# EAGLE schematic 6ButtonSMDVerteiler (EAGLE 9.6.2)
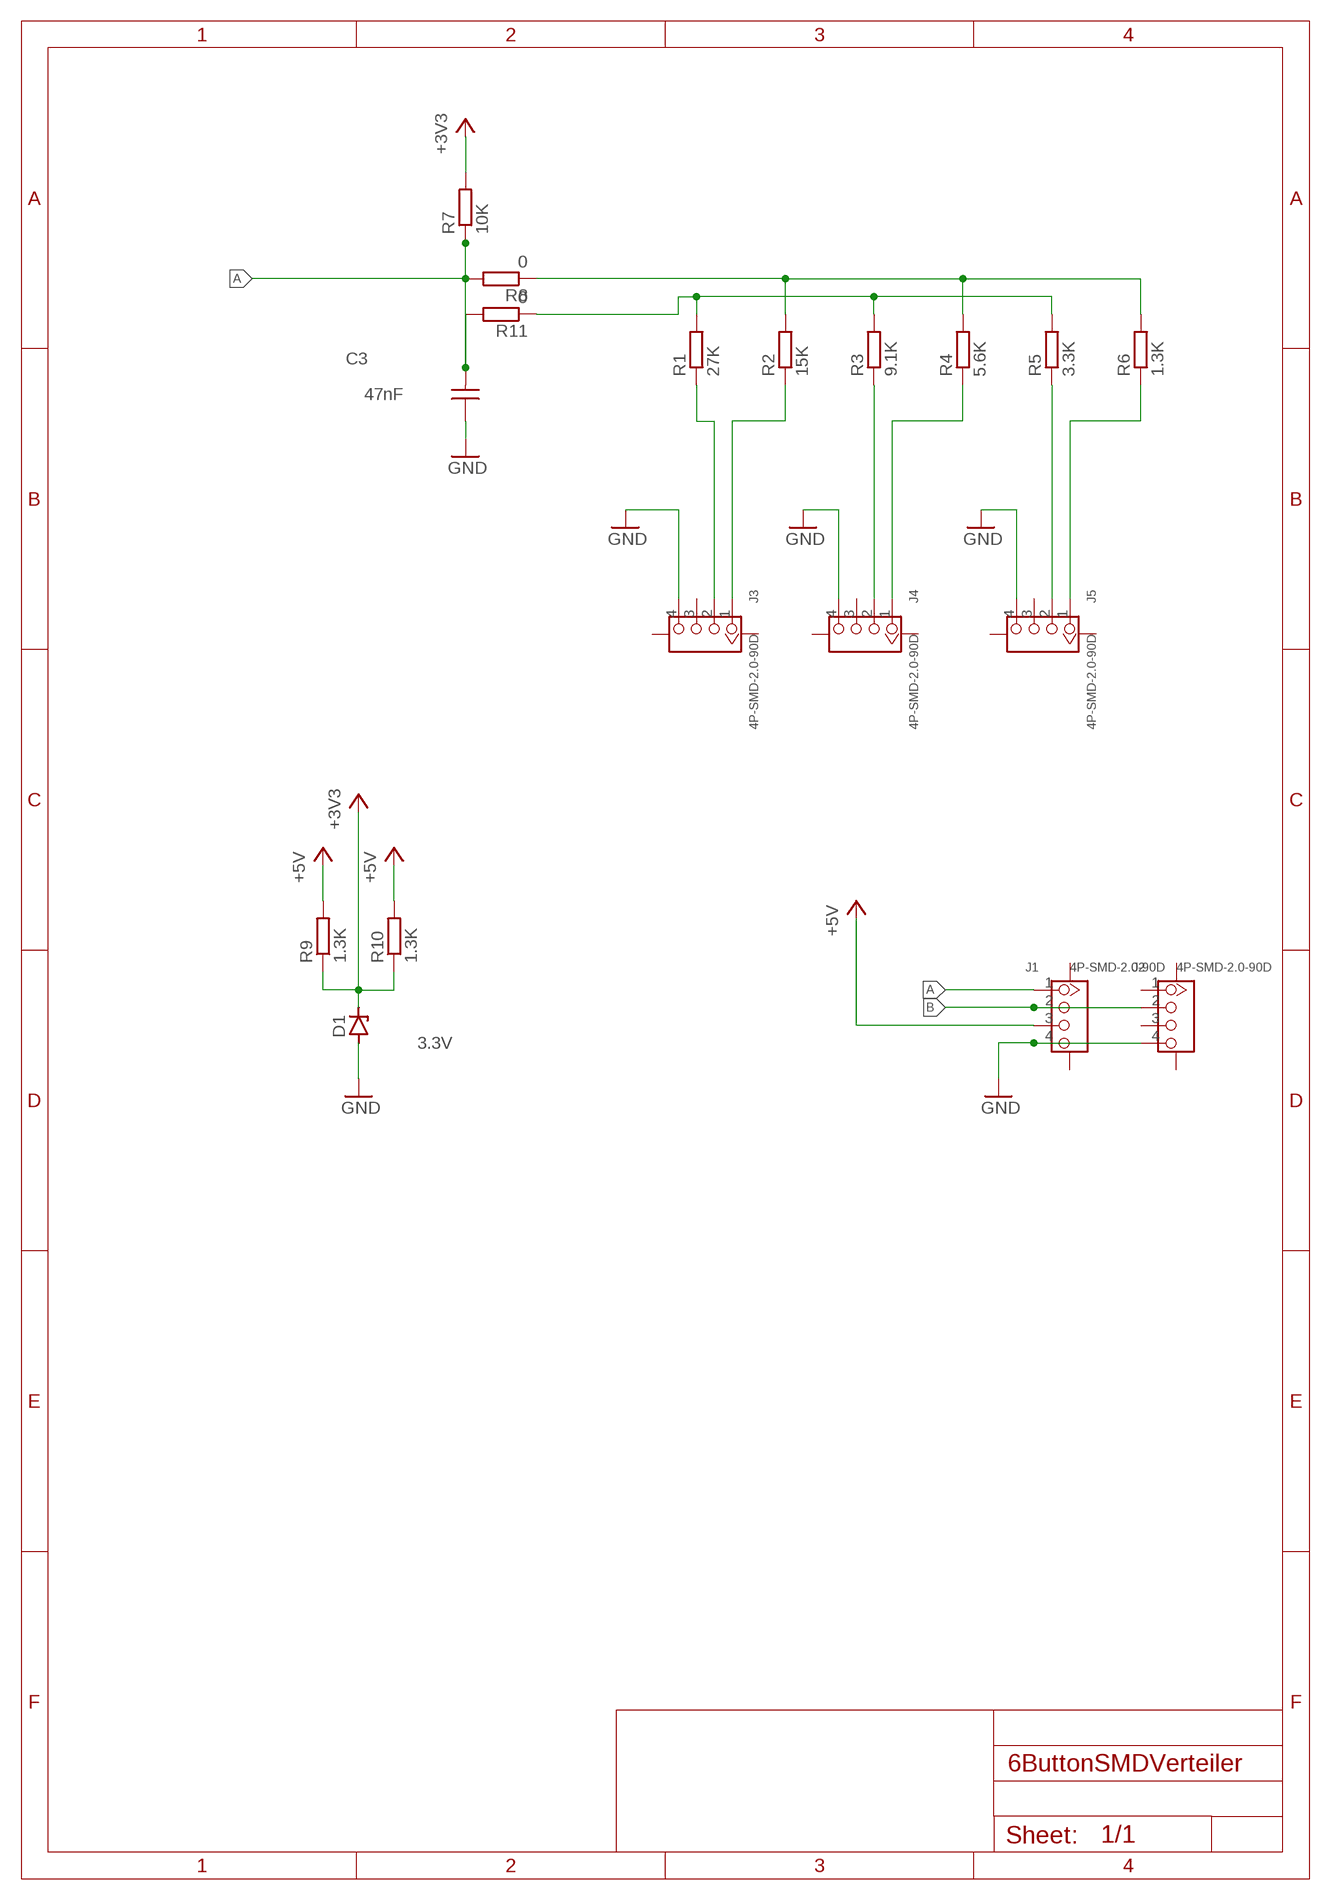
[diagram p0: schematic, sheet 1]

## Parts
C3  47nF  WCAP-CSGP_1206_H0.8_885012208085_50V(DC)  [WCAP-CSGP_1206_H0.8]
D1  3.3V  ZENER-DIODESOD80C  [SOD80C]
J1  4P-SMD-2.0-90D  GROVE-CONNECTOR-SMD-90D(4+2P-2.0)  [HW4-SMD-2.0-90D]
J2  4P-SMD-2.0-90D  GROVE-CONNECTOR-SMD-90D(4+2P-2.0)  [HW4-SMD-2.0-90D]
J3  4P-SMD-2.0-90D  GROVE-CONNECTOR-SMD-90D(4+2P-2.0)  [HW4-SMD-2.0-90D]
J4  4P-SMD-2.0-90D  GROVE-CONNECTOR-SMD-90D(4+2P-2.0)  [HW4-SMD-2.0-90D]
J5  4P-SMD-2.0-90D  GROVE-CONNECTOR-SMD-90D(4+2P-2.0)  [HW4-SMD-2.0-90D]
R1  27K  R-EU_R1206  [R1206]
R2  15K  R-EU_R1206  [R1206]
R3  9.1K  R-EU_R1206  [R1206]
R4  5.6K  R-EU_R1206  [R1206]
R5  3.3K  R-EU_R1206  [R1206]
R6  1.3K  R-EU_R1206  [R1206]
R7  10K  R-EU_R1206  [R1206]
R8  0  R-EU_R1206  [R1206]
R9  1.3K  R-EU_R1206  [R1206]
R10  1.3K  R-EU_R1206  [R1206]
R11  0  R-EU_R1206  [R1206]

## Nets
+3V3: D1.C R7.2 R9.1 R10.1
+5V: J1.3 R9.2 R10.2
A: C3.2 J1.1 R7.1 R8.2 R11.2
B: J1.2 J2.2
GND: C3.1 D1.A J1.4 J2.4 J3.4 J4.4 J5.4
N$1: J3.2 R1.1
N$2: J3.1 R2.1
N$3: J4.2 R3.1
N$4: J4.1 R4.1
N$5: J5.2 R5.1
N$6: J5.1 R6.1
N$27: R2.2 R4.2 R6.2 R8.1
N$30: R1.2 R3.2 R5.2 R11.1
Unconnected: J1.SS1 J1.SS2 J2.1 J2.3 J2.SS1 J2.SS2 J3.3 J3.SS1 J3.SS2 J4.3 J4.SS1 J4.SS2 J5.3 J5.SS1 J5.SS2

## Library data of the parts
C3 = Wurth_Capacitors_WCAP-CSGP:WCAP-CSGP_1206_H0.8: WCAP-CSGP MLCCs 1206 Characteristics General purpose product series High performance ceramic High electrical precision and stability ceramic especially for NP0 Minimal aging especially for NP0 Mounting style: SMT-Chip Ceramic: NP0 (Class I), X5R (Class II), X7R (Class II) Temperature coefficient: ±30 ppm/°C; ±0.54 % for NP0 ±15 % for X5R and X7R Operating temperature: -55 °C up to + 125 °C for NP0 and X7R -55 °C up to + 85 °C for X5R Termination: Cu/Ni/Sn Recommended soldering: Reflow soldering Wave soldering for size 0603 Wave soldering for size 0805 (only valid for the thickness ≤0.85 mm) Applications Temperature compensation (NP0) Coupling Decoupling Bypass Smoothing Filtering Resonant circuit <https://www.we-online.com/catalog/media/o177837v209%20MLCC_GRP_all.jpg> Details see: https://www.we-online.com/catalog/en/pbs/capacitors/multilayer_ceramic_chip_capacitors/mlcc_general_purpose Updated by yingchun,Shan;2020-03-09 2020(C) Würth Elektronik; CERAMIC-TYPE: X7R Class II; DATASHEET-URL: https://www.we-online.com/redexpert/spec/885012208085?ae; DF: 2.5%; HEIGHT: 0.8mm; MOUNT: SMT; OPERATING-TEMPERATURE: -55 up to +125 °C; PART-NUMBER: 885012208085; QMIN: -; RISO: 10GOhm; SIZE: 1206; TECHNICAL-REFERENCE: X7R1206473K050DFCT1000; VR: 50V(DC)
D1 = diode:ZENER-DIODE: Z-Diode
J1-J5 = OPL_Connector:GROVE-CONNECTOR-SMD-90D(4+2P-2.0): 320110032
R1-R11 = rcl:R-EU_: RESISTOR, European symbol; SPICEPREFIX: R